# EAGLE design buttons (EAGLE 9.6.2)
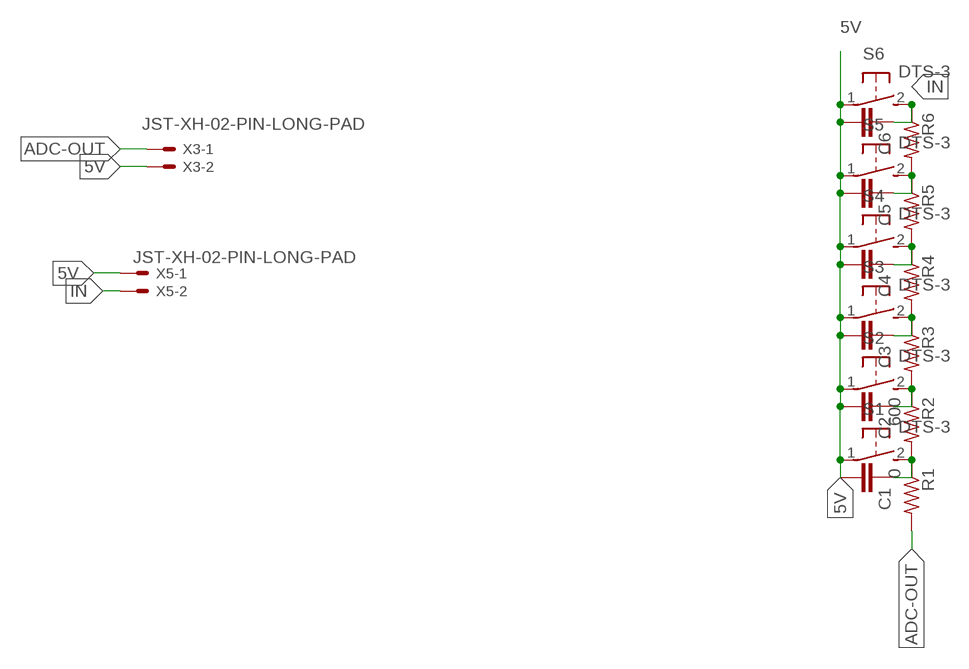
[diagram p0: schematic, sheet 1]

## Parts
C1  C-EU025-024X044  [C025-024X044]
C2  C-EU025-024X044  [C025-024X044]
C3  C-EU025-024X044  [C025-024X044]
C4  C-EU025-024X044  [C025-024X044]
C5  C-EU025-024X044  [C025-024X044]
C6  C-EU025-024X044  [C025-024X044]
R1  0  R-US_0204/7  [0204/7]
R2  600  R-US_0204/7  [0204/7]
R3  R-US_0204/7  [0204/7]
R4  R-US_0204/7  [0204/7]
R5  R-US_0204/7  [0204/7]
R6  R-US_0204/7  [0204/7]
S1  DTS-3  [DTS-3]
S2  DTS-3  [DTS-3]
S3  DTS-3  [DTS-3]
S4  DTS-3  [DTS-3]
S5  DTS-3  [DTS-3]
S6  DTS-3  [DTS-3]
X3  JST-XH-02-PIN-LONG-PAD  [JST-XH-02-PACKAGE-LONG-PAD]
X5  JST-XH-02-PIN-LONG-PAD  [JST-XH-02-PACKAGE-LONG-PAD]

## Nets
5V: C1.2 C2.2 C3.2 C4.2 C5.2 C6.2 S1.1 S2.1 S3.1 S4.1 S5.1 S6.1 X3.2 X5.1
ADC-OUT: R1.2 X3.1
IN: C6.1 R6.1 S6.2 X5.2
N$1: C1.1 R1.1 R2.2 S1.2
N$3: C2.1 R2.1 R3.2 S2.2
N$5: C3.1 R3.1 R4.2 S3.2
N$7: C4.1 R4.1 R5.2 S4.2
N$9: C5.1 R5.1 R6.2 S5.2

## Library data of the parts
C1-C6 = rcl:C-EU: CAPACITOR, European symbol; SPICEPREFIX: C
R1-R6 = rcl:R-US_: RESISTOR, American symbol; SPICEPREFIX: R
S1-S6 = switch-tact:DTS-3
X3 X5 = connector-data - JST XH Connectors v1-0:JST-XH-02-PIN: JST XH Connector 2 Pin Wire to board connector. Pitch: 2,54 mm, (0.100") Number of pins: 2 Created by Rembrandt Electronics www.rembrandtelectronics.com

## Board
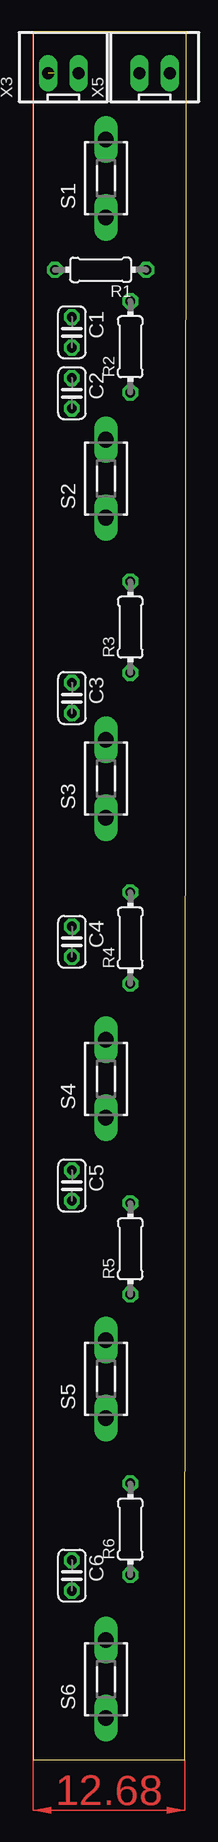
[diagram p1: board, top side]
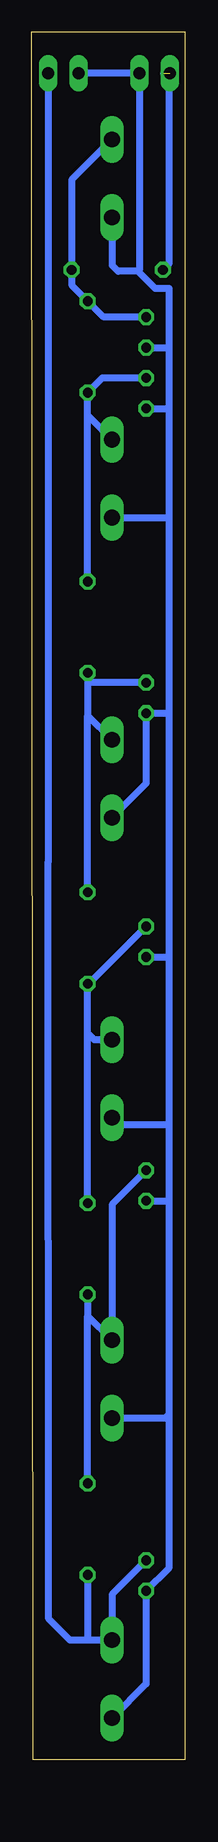
[diagram p2: board, bottom side, seen from below]

Size 12.81 x 144.07 mm. Coordinates in mm from the lower left corner, seen from the top.
Outline: 0,0 12.68,0 12.81,144.07 0,144.07 0,0
Copper layers (1*16): Top 0.035mm / dielectric 1.5mm / Bottom 0.035mm
Design rules "default *": minimum track width 6mil, minimum drill 0.35mm, track to track 0.6mm, track to pad 0.6mm, pad to pad 0.6mm, via to via 0.6mm, smd to smd 6mil, copper to edge 40mil, drill to drill 6mil, minimum pad ring 10mil, minimum via ring 8mil, stop-mask expansion 4mil, vias tented up to drill 0mil, thermal gap 10mil
Holes 3 mm at 0.51,-91.82 11.94,-91.82

### Footprints (pad centres in the part's own frame; a part is rotated, then mirrored left to right if it is on the bottom)
C025-024X044 = drill 0.813 octagon: 1 -1.27,0; 2 1.27,0
0204/7 = drill 0.813 octagon: 1 -3.81,0; 2 3.81,0
DTS-3 = drill 1.3 long: 1 -3.25,0; 2 3.25,0
JST-XH-02-PACKAGE-LONG-PAD = drill 1.016 long: 1 -1.27,0; 2 1.27,0

### Placement (x,y rotation side)
C1  3.25,119 270 top
C2  3.25,113.92 270 top
C3  3.25,88.52 270 top
C4  3.25,68.2 270 top
C5  3.25,47.88 270 top
C6  3.25,15.37 270 top
R1  5.66,124.21 180 top
R2  8.13,117.79 90 top
R3  8.13,94.42 90 top
R4  8.13,68.51 90 top
R5  8.13,42.6 90 top
R6  8.13,19.24 90 top
S1  6.1,131.83 90 top
S2  6.1,106.81 90 top
S3  6.1,81.79 90 top
S4  6.1,56.77 90 top
S5  6.1,31.75 90 top
S6  6.1,6.73 90 top
X3  2.54,140.59 0 top
X5  10.16,140.59 0 top

### Tracks (layer width: path | path; a pad name or v marks a point on that pad's centre or on a via)
5V
  Bottom 0.6: S6.1 3.25,6.33 C6.2 1.32,16.03 1.32,28.83 | 3.93,124.08 5.59,124.08 6.1,124.59 S1.1 | 3.93,124.08 2.49,122.65 1.32,122.65 1.32,117.73 | 1.32,28.83 1.32,46.61 | 1.32,46.61 1.32,52.96 | 1.32,52.96 1.32,66.93 | 1.32,66.93 1.32,87.25 | 1.32,87.25 1.32,103.76 | 1.32,103.76 1.32,112.65 | 1.32,112.65 1.32,117.73 | C1.2 1.32,117.73 | C2.2 1.32,112.65 | S2.1 1.52,103.56 1.32,103.76 | S3.1 3.25,81.39 C3.2 1.32,87.25 | C4.2 1.32,66.93 | S4.1 5.54,52.96 1.32,52.96 | C5.2 1.32,46.61 | S5.1 1.65,28.5 1.32,28.83 | 3.93,124.08 3.81,124.2 X3.2 X5.1
ADC-OUT  (1 unrouted)
  Bottom 0.6: R1.2 1.32,124.74 1.32,140.59 1.78,140.59
IN
  Bottom 0.6: X5.2 11.43,74.87 11.37,11.76 9.6,9.98 8.13,9.98 | 8.13,9.98 S6.2 6.1,13.79 C6.1 | R6.1 8.13,9.98
N$1
  Bottom 0.6: C1.1 6.8,120.27 R2.2 9.47,122.94 R1.1 9.47,131.7 S1.2
N$3
  Bottom 0.6: C2.1 6.92,115.19 R2.1 8.13,112.09 | S2.2 8.13,112.09 | R3.2 8.13,112.09
N$5
  Bottom 0.6: R3.1 8.13,89.79 | 8.13,89.79 8.13,87.25 8.13,87.07 | 8.13,87.07 S3.2 | C3.1 8.13,89.79 | R4.2 8.13,87.07
N$7
  Bottom 0.6: C4.1 8.01,64.7 | 8.01,64.7 R4.1 | R5.2 8.13,60.58 | 8.13,60.58 8.13,64.59 8.01,64.7 | S4.2 7.57,60.02 8.13,60.58
N$9
  Bottom 0.6: R5.1 8.13,37.03 | 8.13,37.03 S5.2 6.1,46.3 C5.1 | R6.2 8.13,37.03
(copper drawn outside any net)
  shapes: Top area x2